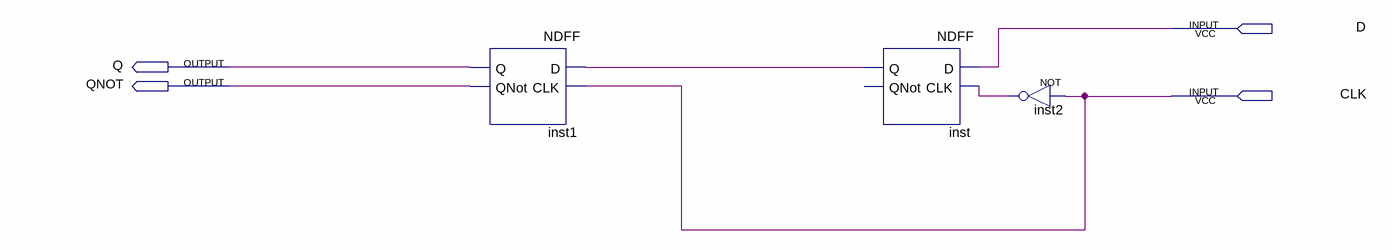
[diagram p0: schematic sheet]
// Quartus schematic UDFF.bdf as structural Verilog: 3 symbols, 4 pins
module UDFF (
  input  D,
  input  CLK,
  output Q,
  output QNOT
);

  wire inst2_out, inst_q;

  NDFF inst1 (.D(inst_q), .CLK(CLK), .Q(Q), .QNot(QNOT));
  NDFF inst (.D(D), .CLK(inst2_out), .Q(inst_q));  // open: QNot
  not inst2 (inst2_out, CLK);
endmodule
